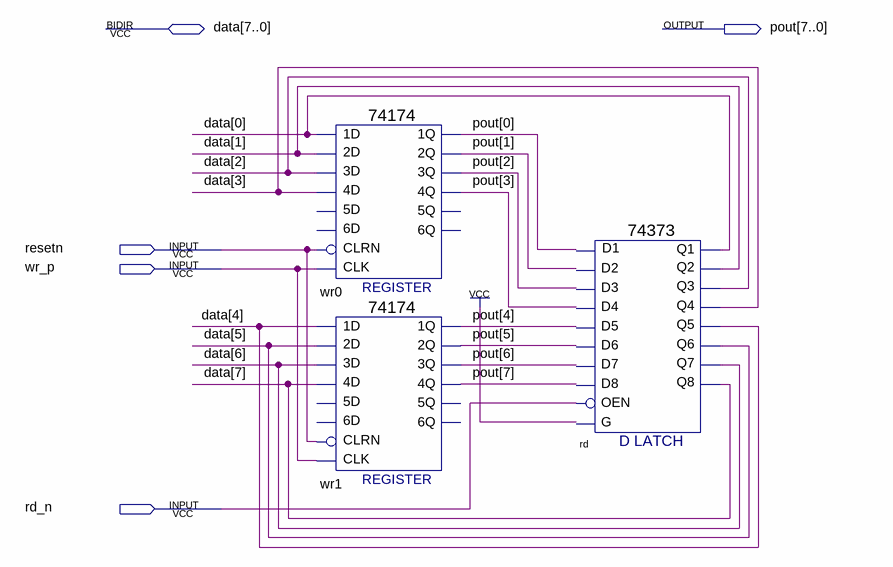
[diagram p0: schematic sheet]
// Quartus schematic port_bl.bdf as structural Verilog: 3 symbols, 5 pins
module port_bl (
  input  resetn,
  input  wr_p,
  input  rd_n,
  inout  [7:0] data,
  output [7:0] pout
);

  \74174  wr0 (
    .\4D (data[3]), .\3D (data[2]), .CLK(wr_p), .CLRN(resetn), .\1D (data[0]), .\2D (data[1]),
    .\1Q (pout[0]), .\4Q (pout[3]), .\3Q (pout[2]), .\2Q (pout[1]));  // open: 5D, 6D, 6Q, 5Q
  \74174  wr1 (
    .\4D (data[7]), .\3D (data[6]), .CLK(wr_p), .CLRN(resetn), .\1D (data[4]), .\2D (data[5]),
    .\1Q (pout[4]), .\4Q (pout[7]), .\3Q (pout[6]), .\2Q (pout[5]));  // open: 5D, 6D, 6Q, 5Q
  \74373  rd (
    .D1(pout[0]), .D3(pout[2]), .D6(pout[5]), .D7(pout[6]), .D2(pout[1]), .G(1'b1), .D4(pout[3]),
    .D5(pout[4]), .D8(pout[7]), .OEN(rd_n), .Q3(data[2]), .Q6(data[5]), .Q7(data[6]), .Q2(data[1]),
    .Q8(data[7]), .Q4(data[3]), .Q5(data[4]), .Q1(data[0]));
endmodule
